# EAGLE design psas_c3_team05 (EAGLE 7.3.0)
DIST: Digi-Key
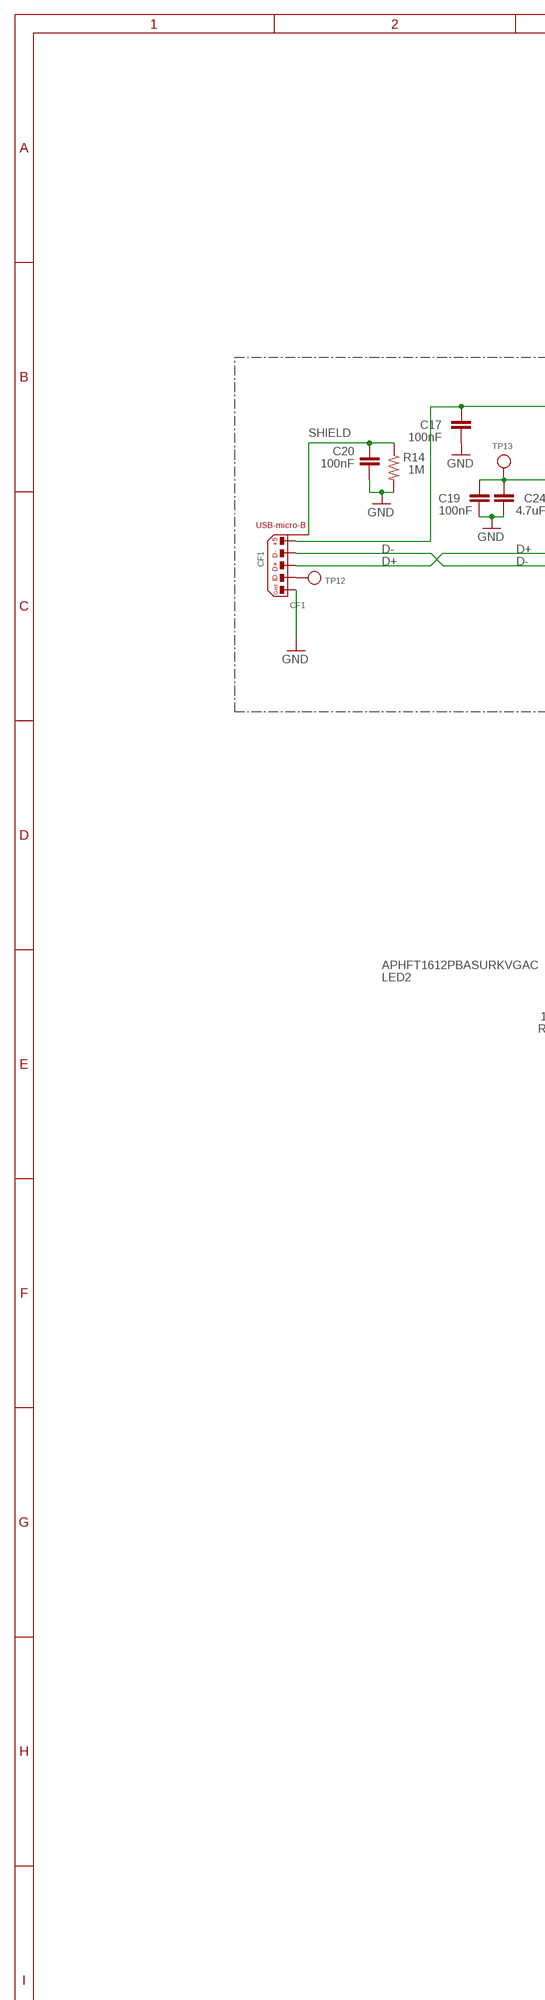
[diagram p0: schematic, sheet 1, part 1 of 2]
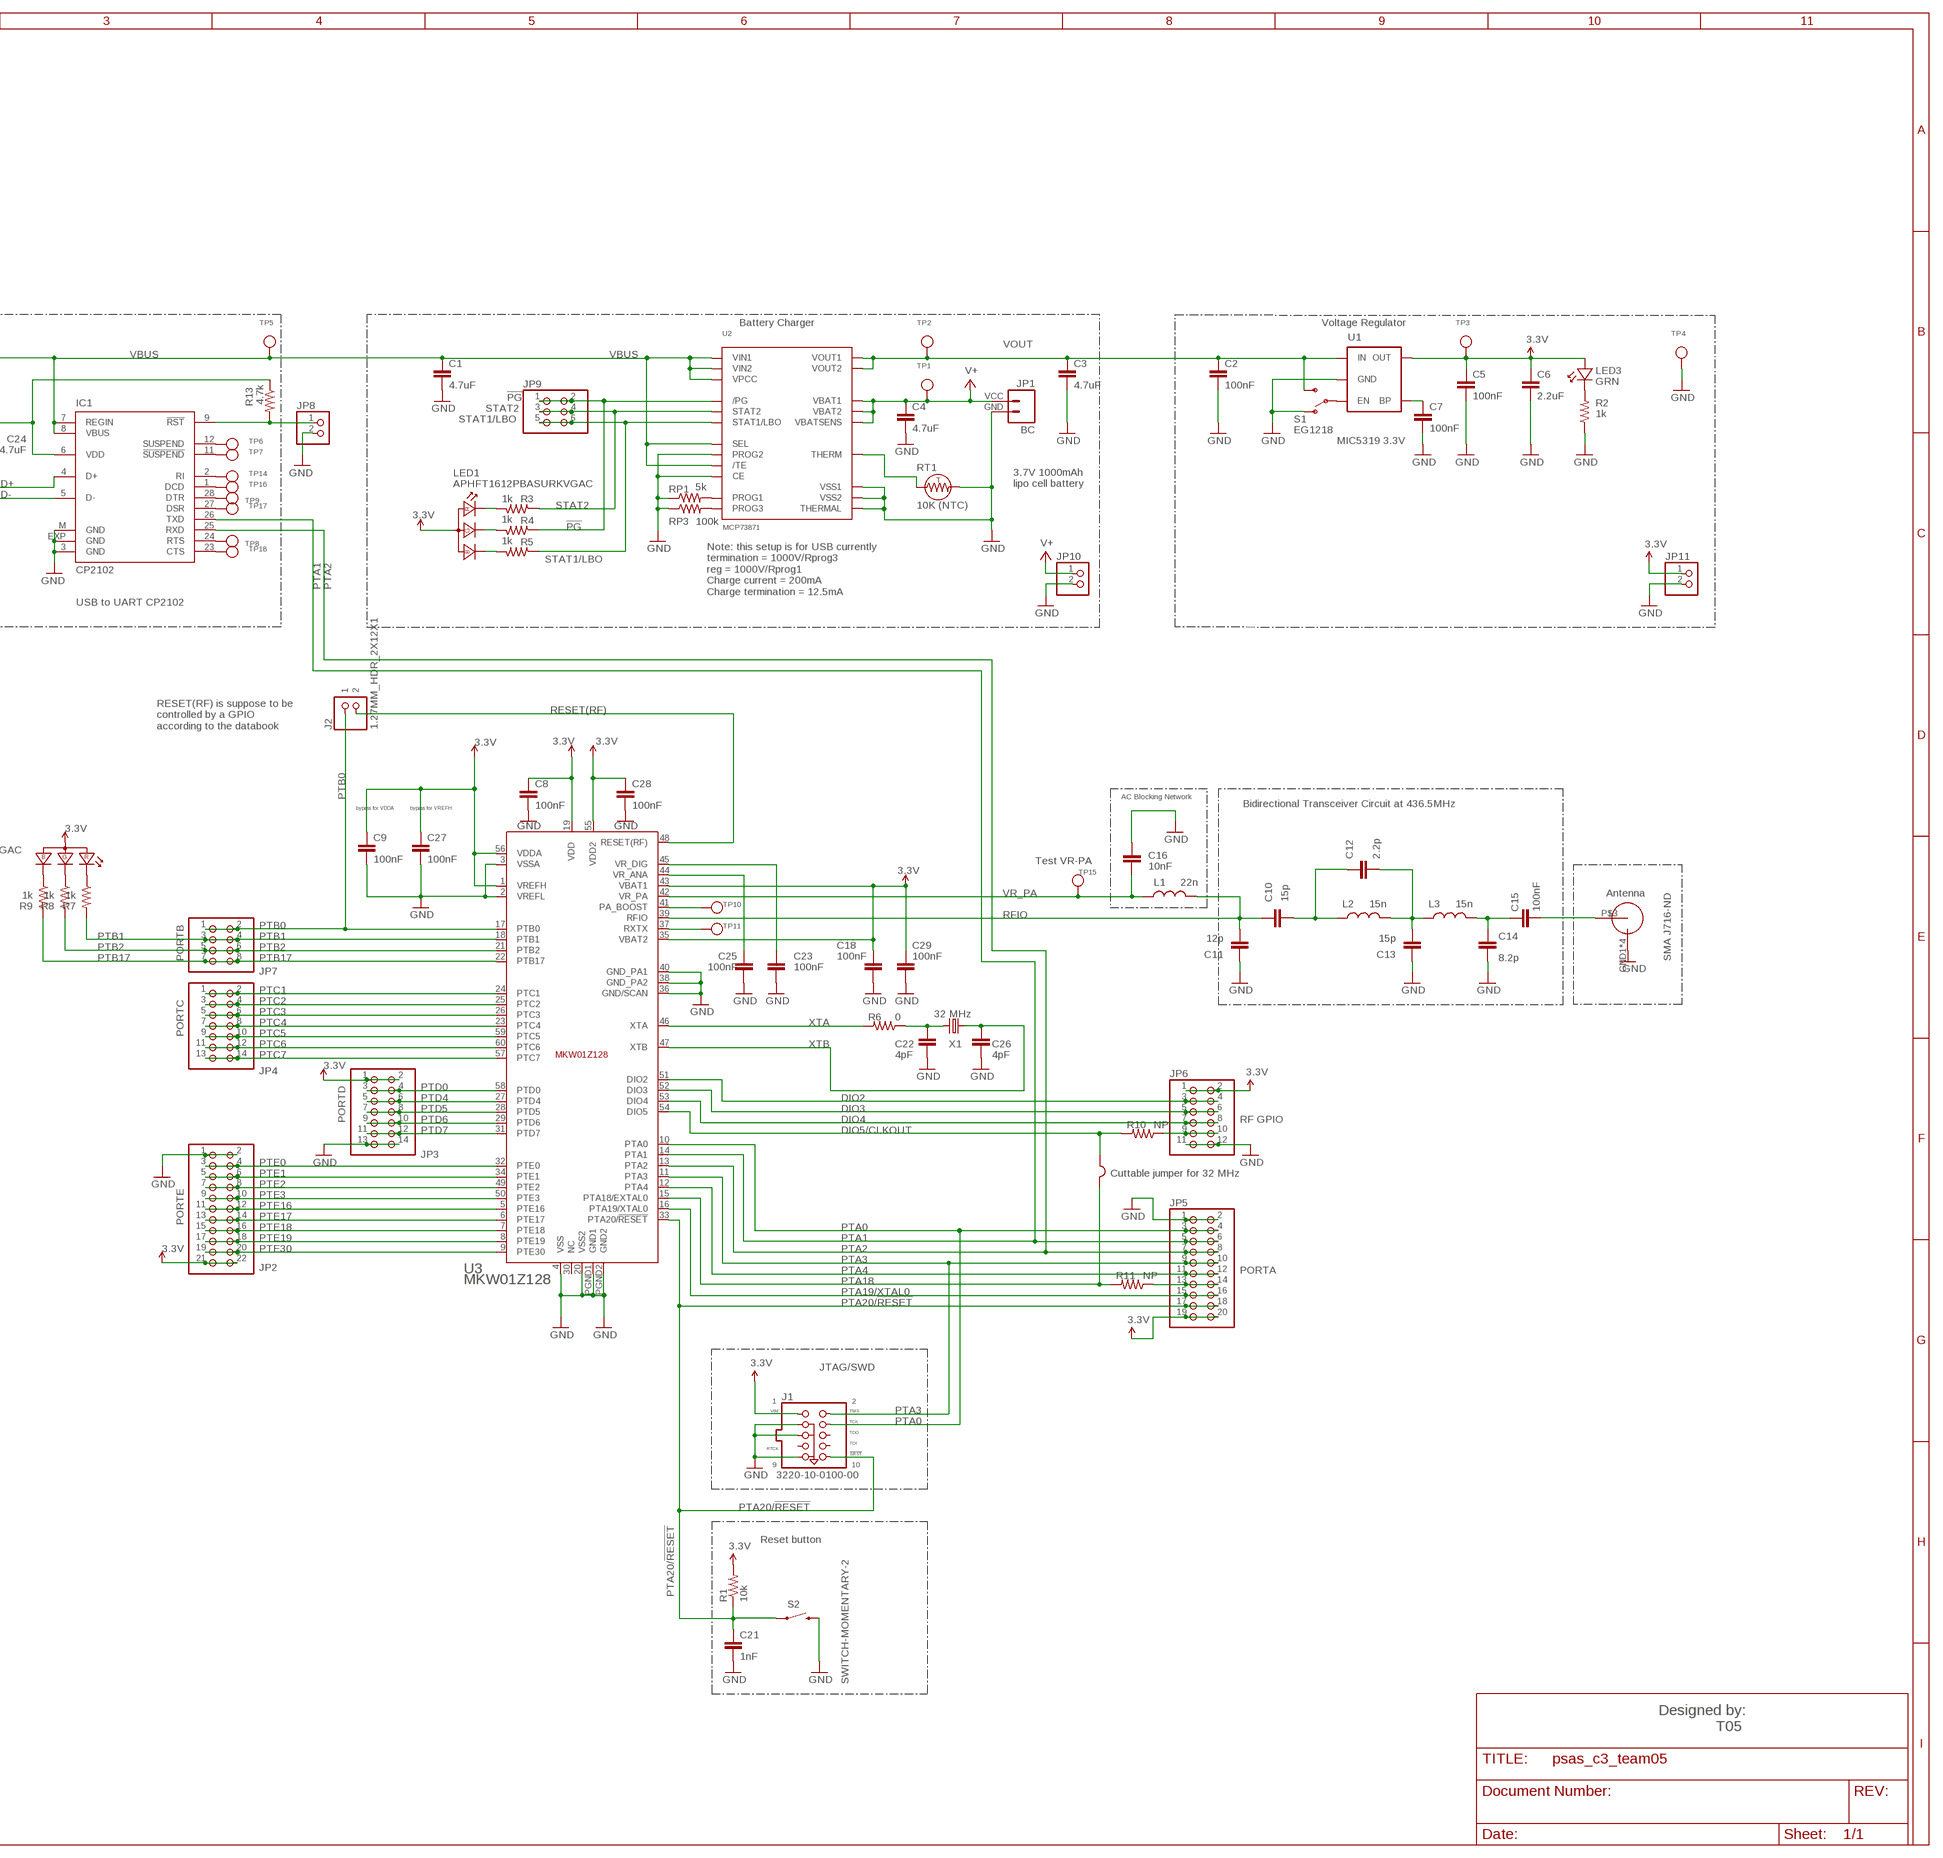
[diagram p1: schematic, sheet 1, part 2 of 2]

## Parts
C1  4.7uF  C-EU0805-B-NOSILK  [.0805-B-NOSILK]
C2  100nF  C-EU0603-B-NOSILK  [.0603-B-NOSILK]
C3  4.7uF  C-EU0805-B-NOSILK  [.0805-B-NOSILK]
C4  4.7uF  C-EU0805-B-NOSILK  [.0805-B-NOSILK]
C5  100nF  C-EU0603-B-NOSILK  [.0603-B-NOSILK]
C6  2.2uF  C-EU0805-B-NOSILK  [.0805-B-NOSILK]
C7  100nF  C-EU0603-B-NOSILK  [.0603-B-NOSILK]
C8  100nF  C-EU0603-B-NOSILK  [.0603-B-NOSILK]
C9  100nF  C-EU0603-B-NOSILK  [.0603-B-NOSILK]
C10  15p  C-EU0603-B-NOSILK  [.0603-B-NOSILK]
C11  12p  C-EU0603-B-NOSILK  [.0603-B-NOSILK]
C12  2.2p  C-EU0603-B-NOSILK  [.0603-B-NOSILK]
C13  15p  C-EU0603-B-NOSILK  [.0603-B-NOSILK]
C14  8.2p  C-EU0603-B-NOSILK  [.0603-B-NOSILK]
C15  100nF  C-EU0603-B-NOSILK  [.0603-B-NOSILK]
C16  10nF  C-EU0603-B-NOSILK  [.0603-B-NOSILK]
C17  100nF  C-EU0603-B-NOSILK  [.0603-B-NOSILK]
C18  100nF  C-EU0603-B-NOSILK  [.0603-B-NOSILK]
C19  100nF  C-EU0603-B-NOSILK  [.0603-B-NOSILK]
C20  100nF  C-EU0603-B-NOSILK  [.0603-B-NOSILK]
C21  1nF  C-EU0603-B-NOSILK  [.0603-B-NOSILK]
C22  4pF  C-EU0603-B-NOSILK  [.0603-B-NOSILK]
C23  100nF  C-EU0603-B-NOSILK  [.0603-B-NOSILK]
C24  4.7uF  C-EU0805-B-NOSILK  [.0805-B-NOSILK]
C25  100nF  C-EU0603-B-NOSILK  [.0603-B-NOSILK]
C26  4pF  C-EU0603-B-NOSILK  [.0603-B-NOSILK]
C27  100nF  C-EU0603-B-NOSILK  [.0603-B-NOSILK]
C28  100nF  C-EU0603-B-NOSILK  [.0603-B-NOSILK]
C29  100nF  C-EU0603-B-NOSILK  [.0603-B-NOSILK]
CF1  CF1  CON_USB-MICRO-B-RECEPTACLE-PTH-HIROSE-ZX62D-B-5P8  [USB-MICRO-B-PTH-HIROSE]
IC1  CP2102  [MLP28]
J1  3220-10-0100-00  JTAG_ARM-10-50MIL  [PINHEADER-2X5-0.05+POL+SILK]
J2  1.27MM_HDR_2X12X1  [1.27MM_2X1]
JP1  BC  SPARKFUN-CONNECTORS_M024UCON-15767  [SPARKFUN-CONNECTORS_JST-2-SMD-VERT]
JP2  PINHD-2X11  [2X11]
JP3  PINHD-2X7  [2X07]
JP4  PINHD-2X7  [2X07]
JP5  PINHD-2X10  [2X10]
JP6  PINHD-2X6  [2X06]
JP7  PINHD-2X4  [2X04]
JP8  PINHD-1X2  [1X02]
JP9  PINHD-2X3  [2X03]
JP10  PINHD-1X2  [1X02]
JP11  PINHD-1X2  [1X02]
L1  22n  L-US0603-B-NOSILK  [.0603-B-NOSILK]
L2  15n  L-US0603-B-NOSILK  [.0603-B-NOSILK]
L3  15n  L-US0603-B-NOSILK  [.0603-B-NOSILK]
LED1  APHFT1612PBASURKVGAC  LED_RGB_COMMON_ANODE-1.6X1.26  [KINGBRITE_RGBLED_1.6X1.26]
LED2  APHFT1612PBASURKVGAC  LED_RGB_COMMON_ANODE-1.6X1.26  [KINGBRITE_RGBLED_1.6X1.26]
LED3  GRN  LED-0603  [LED-0603]
R1  10k  R-US_0603-B-NOSILK  [.0603-B-NOSILK]
R2  1k  R-US_0603-B-NOSILK  [.0603-B-NOSILK]
R3  1k  R-US_0603-B-NOSILK  [.0603-B-NOSILK]
R4  1k  R-US_0603-B-NOSILK  [.0603-B-NOSILK]
R5  1k  R-US_0603-B-NOSILK  [.0603-B-NOSILK]
R6  0  R-US_0603-B-NOSILK  [.0603-B-NOSILK]
R7  1k  R-US_0603-B-NOSILK  [.0603-B-NOSILK]
R8  1k  R-US_0603-B-NOSILK  [.0603-B-NOSILK]
R9  1k  R-US_0603-B-NOSILK  [.0603-B-NOSILK]
R10  NP  R-US_0603-B-NOSILK  [.0603-B-NOSILK]
R11  NP  R-US_0603-B-NOSILK  [.0603-B-NOSILK]
R13  4.7k  R-US_0603-B-NOSILK  [.0603-B-NOSILK]
R14  1M  R-US_0603-B-NOSILK  [.0603-B-NOSILK]
RP1  5k  R-US_0603-B-NOSILK  [.0603-B-NOSILK]
RP3  100k  R-US_0603-B-NOSILK  [.0603-B-NOSILK]
RT1  10K (NTC)  THERMISTOR-_1206  [R1206]
S1  EG1218  SWITCH-SPSTPTH  [SWITCH-SPDT]
S2  SWITCH-MOMENTARY-2  [TACTILE_SWITCH_TALL]
TP1  TESTPOINTROUND0.5MM  [TESTPOINT_ROUND_0.5MM]
TP2  TESTPOINTROUND0.5MM  [TESTPOINT_ROUND_0.5MM]
TP3  TESTPOINTROUND0.5MM  [TESTPOINT_ROUND_0.5MM]
TP4  TESTPOINTROUND0.5MM  [TESTPOINT_ROUND_0.5MM]
TP5  TESTPOINTROUND0.5MM  [TESTPOINT_ROUND_0.5MM]
TP6  TESTPOINTROUND0.5MM  [TESTPOINT_ROUND_0.5MM]
TP7  TESTPOINTROUND0.5MM  [TESTPOINT_ROUND_0.5MM]
TP8  TESTPOINTROUND0.5MM  [TESTPOINT_ROUND_0.5MM]
TP9  TESTPOINTROUND0.5MM  [TESTPOINT_ROUND_0.5MM]
TP10  TESTPOINTROUND0.5MM  [TESTPOINT_ROUND_0.5MM]
TP11  TESTPOINTROUND0.5MM  [TESTPOINT_ROUND_0.5MM]
TP12  TESTPOINTROUND0.5MM  [TESTPOINT_ROUND_0.5MM]
TP13  TESTPOINTROUND0.5MM  [TESTPOINT_ROUND_0.5MM]
TP14  TESTPOINTROUND0.5MM  [TESTPOINT_ROUND_0.5MM]
TP15  TESTPOINTROUND0.5MM  [TESTPOINT_ROUND_0.5MM]
TP16  TESTPOINTROUND0.5MM  [TESTPOINT_ROUND_0.5MM]
TP17  TESTPOINTROUND0.5MM  [TESTPOINT_ROUND_0.5MM]
TP18  TESTPOINTROUND0.5MM  [TESTPOINT_ROUND_0.5MM]
U1  MIC5319 3.3V  SPARKFUN-POWERIC_V_REG_MIC52193.3V  [SPARKFUN-POWERIC_SOT23-5]
U2  MCP73871  [QFN20_4MM]
U3  MKW01Z128  [MKW01Z128]
U$2  SMAJ716-ND  [SMAJ716-ND]
W1  CONNECTION-0.4  [CONNECTION-BUTT-0.4]
X1  32 MHz  FC-12M  [FC-12M]

## Nets
3.3V: C5.1 C6.1 C8.1 C9.1 C18.1 C27.1 C28.1 C29.1 J1.1(VDD) JP2.21 JP2.22 JP3.1 JP3.2 JP5.19 JP5.20 JP6.1 JP6.2 JP11.1 LED1.2(COMMON_ANODE) LED2.2(COMMON_ANODE) LED3.A R1.2 TP3.P$1 U1.5(OUT) U3.1(VREFH) U3.19(VDD) U3.35(VBAT2) U3.43(VBAT1) U3.55(VDD2) U3.56(VDDA)
!PG: JP9.1 JP9.2 R4.1 U2.P$6(/PG)
CP2102_VDD: C19.1 C24.1 IC1.6(VDD) R13.1 TP13.P$1
D+: CF1.3 IC1.4(D+)
D-: CF1.2 IC1.5(D-)
DIO2: JP6.3 JP6.4 U3.51(DIO2)
DIO3: JP6.5 JP6.6 U3.52(DIO3)
DIO4: JP6.7 JP6.8 U3.53(DIO4)
DIO5-JMP: JP6.9 JP6.10 R10.1
DIO5/CLKOUT: R10.2 U3.54(DIO5) W1.P1
GND: C1.2 C2.2 C3.2 C4.2 C5.2 C6.2 C7.2 C8.2 C9.2 C11.2 C13.2 C14.2 C16.1 C17.2 C18.2 C19.2 C20.2 C21.2 C22.2 C23.2 C24.2 C25.2 C26.2 C27.2 C28.2 C29.2 CF1.5 IC1.3(GND) IC1.EXP(GND) IC1.M(GND) J1.3(GND3) J1.5(GND5) J1.9(GND9) JP1.GND JP2.1 JP2.2 JP3.13 JP3.14 JP5.1 JP5.2 JP6.11 JP6.12 JP8.2 JP10.2 JP11.2 R2.1 R14.2 RP1.1 RP3.1 RT1.2 S1.1(O) S2.B2 TP4.P$1 U1.2(GND) U2.P$4(PROG2) U2.P$10(VSS1) U2.P$11(VSS2) U2.P$17(CE) U2.P$21(THERMAL) U3.2(VREFL) U3.3(VSSA) U3.4(VSS) U3.20(VSS2) U3.36(GND/SCAN) U3.38(GND_PA2) U3.40(GND_PA1) U3.PGND1(GND1) U3.PGND2(GND2) U$2.GND1(OUTERCONDUCTOR) U$2.GND2(OUTERCONDUCTOR) U$2.GND3(OUTERCONDUCTOR) U$2.GND4(OUTERCONDUCTOR)
N$1: C7.1 U1.4(BP)
N$2: LED1.3(RK) R3.2
N$3: LED1.4(GK) R4.2
N$4: LED1.1(BK) R5.2
N$5: IC1.12(SUSPEND) TP6.P$1
N$6: RT1.1 U2.P$5(THERM)
N$7: IC1.11(!SUSPEND) TP7.P$1
N$8: S1.2(P) U1.3(EN)
N$9: RP1.2 U2.P$13(PROG1)
N$10: RP3.2 U2.P$12(PROG3)
N$11: IC1.24(RTS) TP8.P$1
N$12: C22.1 R6.1 X1.2
N$13: TP10.P$1 U3.41(PA_BOOST)
N$15: TP11.P$1 U3.37(RXTX)
N$17: C12.1 C13.1 L2.2 L3.1
N$18: C10.1 C12.2 L2.1
N$19: C15.2 U$2.P$3(CENTERCONDUCTOR)
N$21: C14.1 C15.1 L3.2
N$25: IC1.2(RI) TP14.P$1
N$26: IC1.28(DTR) TP9.P$1
N$27: IC1.1(DCD) TP16.P$1
N$28: IC1.27(DSR) TP17.P$1
N$29: IC1.23(CTS) TP18.P$1
N$30: IC1.9(!RST) JP8.1 R13.2
N$31: LED3.K R2.2
N$32: LED2.1(BK) R9.1
N$33: LED2.4(GK) R8.1
N$34: LED2.3(RK) R7.1
N$150: CF1.4 TP12.P$1
PTA0: J1.4(TCK) JP5.3 JP5.4 U3.10(PTA0)
PTA1: IC1.26(TXD) JP5.5 JP5.6 U3.14(PTA1)
PTA2: IC1.25(RXD) JP5.7 JP5.8 U3.13(PTA2)
PTA3: J1.2(TMS) JP5.9 JP5.10 U3.11(PTA3)
PTA4: JP5.11 JP5.12 U3.12(PTA4)
PTA18: R11.2 U3.15(PTA18/EXTAL0) W1.P2
PTA18-JMP: JP5.13 JP5.14 R11.1
PTA19/XTAL0: JP5.15 JP5.16 U3.16(PTA19/XTAL0)
PTA20/!RESET: C21.1 J1.10(SRST) JP5.17 JP5.18 R1.1 S2.A2 U3.33(PTA20/!RESET)
PTB0: J2.1 JP7.1 JP7.2 U3.17(PTB0)
PTB1: JP7.3 JP7.4 R7.2 U3.18(PTB1)
PTB2: JP7.5 JP7.6 R8.2 U3.21(PTB2)
PTB17: JP7.7 JP7.8 R9.2 U3.22(PTB17)
PTC1: JP4.1 JP4.2 U3.24(PTC1)
PTC2: JP4.3 JP4.4 U3.25(PTC2)
PTC3: JP4.5 JP4.6 U3.26(PTC3)
PTC4: JP4.7 JP4.8 U3.23(PTC4)
PTC5: JP4.9 JP4.10 U3.59(PTC5)
PTC6: JP4.11 JP4.12 U3.60(PTC6)
PTC7: JP4.13 JP4.14 U3.57(PTC7)
PTD0: JP3.3 JP3.4 U3.58(PTD0)
PTD4: JP3.5 JP3.6 U3.27(PTD4)
PTD5: JP3.7 JP3.8 U3.28(PTD5)
PTD6: JP3.9 JP3.10 U3.29(PTD6)
PTD7: JP3.11 JP3.12 U3.31(PTD7)
PTE0: JP2.3 JP2.4 U3.32(PTE0)
PTE1: JP2.5 JP2.6 U3.34(PTE1)
PTE2: JP2.7 JP2.8 U3.49(PTE2)
PTE3: JP2.9 JP2.10 U3.50(PTE3)
PTE16: JP2.11 JP2.12 U3.5(PTE16)
PTE17: JP2.13 JP2.14 U3.6(PTE17)
PTE18: JP2.15 JP2.16 U3.7(PTE18)
PTE19: JP2.17 JP2.18 U3.8(PTE19)
PTE30: JP2.19 JP2.20 U3.9(PTE30)
RESET(RF): J2.2 U3.48(RESET(RF))
RFIO: C10.2 C11.1 L1.2 U3.39(RFIO)
SHIELD: C20.1 CF1.S1(SHIELD) CF1.S2(SHIELD) CF1.S3(SHIELD) CF1.S4(SHIELD) R14.1
STAT1/LBO: JP9.5 JP9.6 R5.1 U2.P$8(STAT1/LBO)
STAT2: JP9.3 JP9.4 R3.1 U2.P$7(STAT2)
V+: C4.1 JP1.VCC JP10.1 TP1.P$1 U2.P$14(VBAT1) U2.P$15(VBAT2) U2.P$16(VBATSENS)
VBUS: C1.1 C17.1 CF1.1 IC1.7(REGIN) IC1.8(VBUS) TP5.P$1 U2.P$2(VPCC) U2.P$3(SEL) U2.P$9(/TE) U2.P$18(VIN1) U2.P$19(VIN2)
VOUT: C2.1 C3.1 S1.3(S) TP2.P$1 U1.1(IN) U2.P$1(VOUT1) U2.P$20(VOUT2)
VR_ANA: C25.1 U3.44(VR_ANA)
VR_DIG: C23.1 U3.45(VR_DIG)
VR_PA: C16.2 L1.1 TP15.P$1 U3.42(VR_PA)
XTA: R6.2 U3.46(XTA)
XTB: C26.1 U3.47(XTB) X1.1
Unconnected: J1.6(TDO) J1.7(RTCK) J1.8(TDI) U3.30(NC)

## Notes on the sheet
- Battery Charger | Voltage Regulator
- 3.7V 1000mAh
  lipo cell battery
- Note: this setup is for USB currently
  termination = 1000V/Rprog3
  reg = 1000V/Rprog1
  Charge current = 200mA
  Charge termination = 12.5mA
- USB to UART CP2102
- RESET(RF) is suppose to be
  controlled by a GPIO
  according to the databook
- AC Blocking Network | Bidirectional Transceiver Circuit at 436.5MHz
- bypass for VDDA | bypass for VREFH
- Test VR-PA
- Antenna
- PORTB | SMA J716-ND
- PORTC
- PORTD | RF GPIO
- Cuttable jumper for 32 MHz
- PORTE
- PORTA
- JTAG/SWD
- Reset button
- Designed by:
  T05

## Library data of the parts
C1 C3 C4 C24 = rcl_custom:C-EU: CAPACITOR, European symbol; DIST: Digi-Key; DPN: 732-7657-1-ND; MFG: Wurth Electronics Inc; MFG-PN: 885012207025
C2 C5 C7 C17 C19 C20 = rcl_custom:C-EU: CAPACITOR, European symbol; DIST: Digi-Key; DPN: 490-1532-1-ND; MFG: Murata Electronics North America; MFG-PN: GRM188R71C104KA01D
C6 = rcl_custom:C-EU: CAPACITOR, European symbol; DIST: Digi-Key; DPN: 490-3906-1-ND; MFG: Murata Electronics North America; MFG-PN: GRM21BR71C225KA12L
C8 C9 C18 C23 C25 C27-C29 = Vibrogait_prototype:C-EU: CAPACITOR, European symbol; DIST: Digi-Key; DPN: 490-1532-1-ND; MFG: Murata Electronics North America; MPN: GRM188R71C104KA01D
C10 C13 = rcl_custom:C-EU: CAPACITOR, European symbol; DIST: Digi-Key; DPN: 478-6024-1-ND; MFG: AVX; MFG-PN: 06031A150FAT2A
C11 = rcl_custom:C-EU: CAPACITOR, European symbol; DIST: Mouser; DPN: 581-06035A120FAT2A; MFG: AVX; MFG-PN: 06035A120FAT2A
C12 = rcl_custom:C-EU: CAPACITOR, European symbol; DIST: Mouser; DPN: 77-VJ0603A2R2BXJPBC; MFG: Vishay / Vitramon; MFG-PN: VJ0603A2R2BXJPW1BC
C14 = rcl_custom:C-EU: CAPACITOR, European symbol; DIST: Mouser; DPN: 609-251R14S8R2BV4T; MFG: Johanson Technology; MFG-PN: 251R14S8R2BV4T
C15 = rcl_custom:C-EU: CAPACITOR, European symbol; DIST: Digi-Key; DPN: 478-5778-1-ND; MFG: AVX; MFG-PN: 06035C104JAT2A
C16 = rcl_custom:C-EU: CAPACITOR, European symbol; DIST: Digi-Key; DPN: 478-6208-1-ND; MFG: AVX; MFG-PN: 0603YC103JAT2A
C21 = rcl_custom:C-EU: CAPACITOR, European symbol; DIST: Digi-Key; DPN: 399-8984-1-ND; MFG: Kemet; MFG-PN: C0603C102K8RACTU
C22 C26 = Vibrogait_prototype:C-EU: CAPACITOR, European symbol; DIST: Digi-Key; DPN: 490-10720-6-ND; MFG: Murata Electronics North America; MPN: GRM1885C1H4R0CA01D
CF1 = Vibrogait_prototype:CON_USB-MICRO-B-RECEPTACLE-*: Standard USB Micro-B receptacle; DIST: Digi-Key; DPN: H11610CT-ND; MFG: Hirose Electric Co Ltd; MFG-PN: ZX62D-B-5P8
IC1 = silabs:CP210*: Single-Chip USB to UART Bridge Source: www.silabs.com .. CP2101.pdf / cp2102.pdf; DIST: Digi-Key; DPN: 336-1160-1-ND; MF: FARNELL; MFG: Silicon Labs; MFG-PN: CP2102-GMR; MPN: CP2102-GM; OC_FARNELL: 9282130; OC_NEWARK: 30K5635
J1 = apdm-ic-v2:JTAG_ARM-10-*: JTAG PIN HEADER 2x5 This is one of the (smaller) ARM standard JTAG connectors.; DIST: Digi-Key; DPN: 1175-1627-ND; MFG: CNC Tech; MFG-PN: 3220-10-0100-00
J2 = headers:1.27MM_HDR_2X1
JP1 = Vibrogait_prototype:SPARKFUN-CONNECTORS_M02: Standard 2-pin 0.1" header. Use with - straight break away headers ( PRT-00116) - right angle break away headers (PRT-00553) - swiss pins (PRT-00743) - machine pins (PRT-00117) - female headers (PRT-00115) Molex polarized connector foot print use with: PRT-08233 with associated crimp pins and housings. 2.54_SCREWTERM for use with PRT-10571. 3.5mm Screw Terminal footprints for PRT-08084 5mm Screw Terminal footprints for use with PRT-08433; DIST: Digi-Key; DPN: 455-1749-1-ND; MFG: JST Sales America Inc.; MFG-PN: S2B-PH-SM4-TB(LF)(SN)
JP2 = pinhead:PINHD-2X11: PIN HEADER
JP3 JP4 = pinhead:PINHD-2X7: PIN HEADER
JP5 = pinhead:PINHD-2X10: PIN HEADER
JP6 = pinhead:PINHD-2X6: PIN HEADER
JP7 = pinhead:PINHD-2X4: PIN HEADER
JP8 JP10 JP11 = pinhead:PINHD-1X2: PIN HEADER
JP9 = pinhead:PINHD-2X3: PIN HEADER
L1 = rcl_custom:L-US: INDUCTOR, American symbol; DIST: Digi-Key; DPN: 490-6874-1-ND; MFG: Murata; MFG-PN: LQW18AN22NG00D
L2 L3 = rcl_custom:L-US: INDUCTOR, American symbol; DIST: Digi-Key; DPN: 490-6866-1-ND; MFG: Murata; MFG-PN: LQW18AN15NG00D
LED1 LED2 = Vibrogait_prototype:LED_RGB_COMMON_ANODE-*: RGB LED with comon anode; DIST: Digi-Key; DPN: 160-2022-1-ND; MFG: Lite-On Inc.; MFG-PN: LTST-C19FD1WT
LED3 = Vibrogait_prototype:LED: Generic LED with Color designator as an attribute.; DIST: Digi-Key; DPN: 160-1446-1-ND; MFG: Lite-On Inc.; MFG-PN: LTST-C191KGKT
R1 = rcl_custom:R-US_: RESISTOR, American symbol; DIST: Digi-Key; DPN: 311-10.0KHRCT-ND; MFG: Yageo; MFG-PN: RC0603FR-0710KL
R2-R5 R7-R9 = rcl_custom:R-US_: RESISTOR, American symbol; DIST: Digi-Key; DPN: 311-1.00KHRCT-ND; MFG: Yageo; MFG-PN: RC0603FR-071KL
R6 R10 R11 = rcl_custom:R-US_: RESISTOR, American symbol
R13 = rcl_custom:R-US_: RESISTOR, American symbol; DIST: Digi-Key; DPN: YAG1317CT-ND; MFG: Yageo; MFG-PN: RC0603JR-074K7P
R14 = rcl_custom:R-US_: RESISTOR, American symbol; DIST: Digi-Key; DPN: 311-1.00MHRCT-ND; MFG: Yageo; MFG-PN: RC0603FR-071ML
RP1 = rcl_custom:R-US_: RESISTOR, American symbol; DIST: Digi-Key; DPN: YAG1305CT-ND; MFG: Yageo; MFG-PN: RC0603FR-074K99P
RP3 = rcl_custom:R-US_: RESISTOR, American symbol; DIST: Digi-Key; DPN: 311-100KHRCT-ND; MFG: Yageo; MFG-PN: RC0603FR-07100KL
RT1 = Vibrogait_prototype:THERMISTOR-: Thermistor; DIST: Digi-Key; DPN: 480-3153-1-ND; MFG: Honeywell Sensing and Control; MFG-PN: 175-103LAE-301
S1 = Vibrogait_prototype:SWITCH-SPST: SPST Switch Simple slide switch. Spark Fun Electronics SKU : COM-00102; DIST: Digi-Key; DPN: EG1903-ND; MFG: E-Switch; MFG-PN: EG1218
S2 = Vibrogait_prototype:SWITCH-MOMENTARY-2; DIST: Digi-Key; DPN: 450-1759-1-ND; MFG: TE Connectivity Alcoswitch Switches; MFG-PN: FSM4JSMATR
TP1-TP18 = microbuilder:TESTPOINT: Test Point Various test points for characterisation and PCB testing TESTPOINT_SMT - Compact Surface Mount Test Point [Digikey: 5016KTR-ND]
U1 = Vibrogait_prototype:SPARKFUN-POWERIC_V_REG_MIC5219: V_REG MIC5219 Standard 3.3V and 5V 500mA LDO voltage regulator in SOT-23 layout. Micrel part MIC5219. BP (by-pass) pin is used to lower output noise with 470pF cap, may be left open.; DIST: Digi-Key; DPN: 576-1910-1-ND; MFG: Microchip Technology; MFG-PN: MIC5319-3.3YD5-TR; PROD_ID: VREG-09872; VALUE: MIC5219 3.3V
U2 = microbuilder:MCP73871: MCP73871 Lithium Polymer Battery Charger Digikey: MCP73871-2CCI/ML-ND; DIST: Digi-Key; DPN: MCP73871-2CCI/ML-ND; MFG: Microchip Technology; MFG-PN: MCP73871-2CCI/ML
U3 = psas_c3_team05:MKW01Z128; DIST: Digi-Key; DPN: MKW01Z128CHN-ND; MFG: Freescale Semiconductor; MFG-PN: MKW01Z128CHN
U$2 = SMAJ16-ND:SMAJ716-ND; DIST: Digi-Key; DPN: J716-ND; MFG: Cinch Connectivity Solutions; MFG-PN: 142-0701-806
W1 = apdm:CONNECTION: Connection Used to electrically connect two different nets. an overlap error will be generated on DRC, no known work around as of v5, though the error can be "approved".
X1 = crystal:FC-12M: kHz RANGE CRYSTAL UNIT LOW PROFILE SMD Source: Epson Toyocom FC-12M.pdf; DIST: Digi-Key; DPN: 1253-1161-1-ND; MFG: AVX Corp/Kyocera Corp; MFG-PN: CX3225GA32000D0PTVCC

## Board
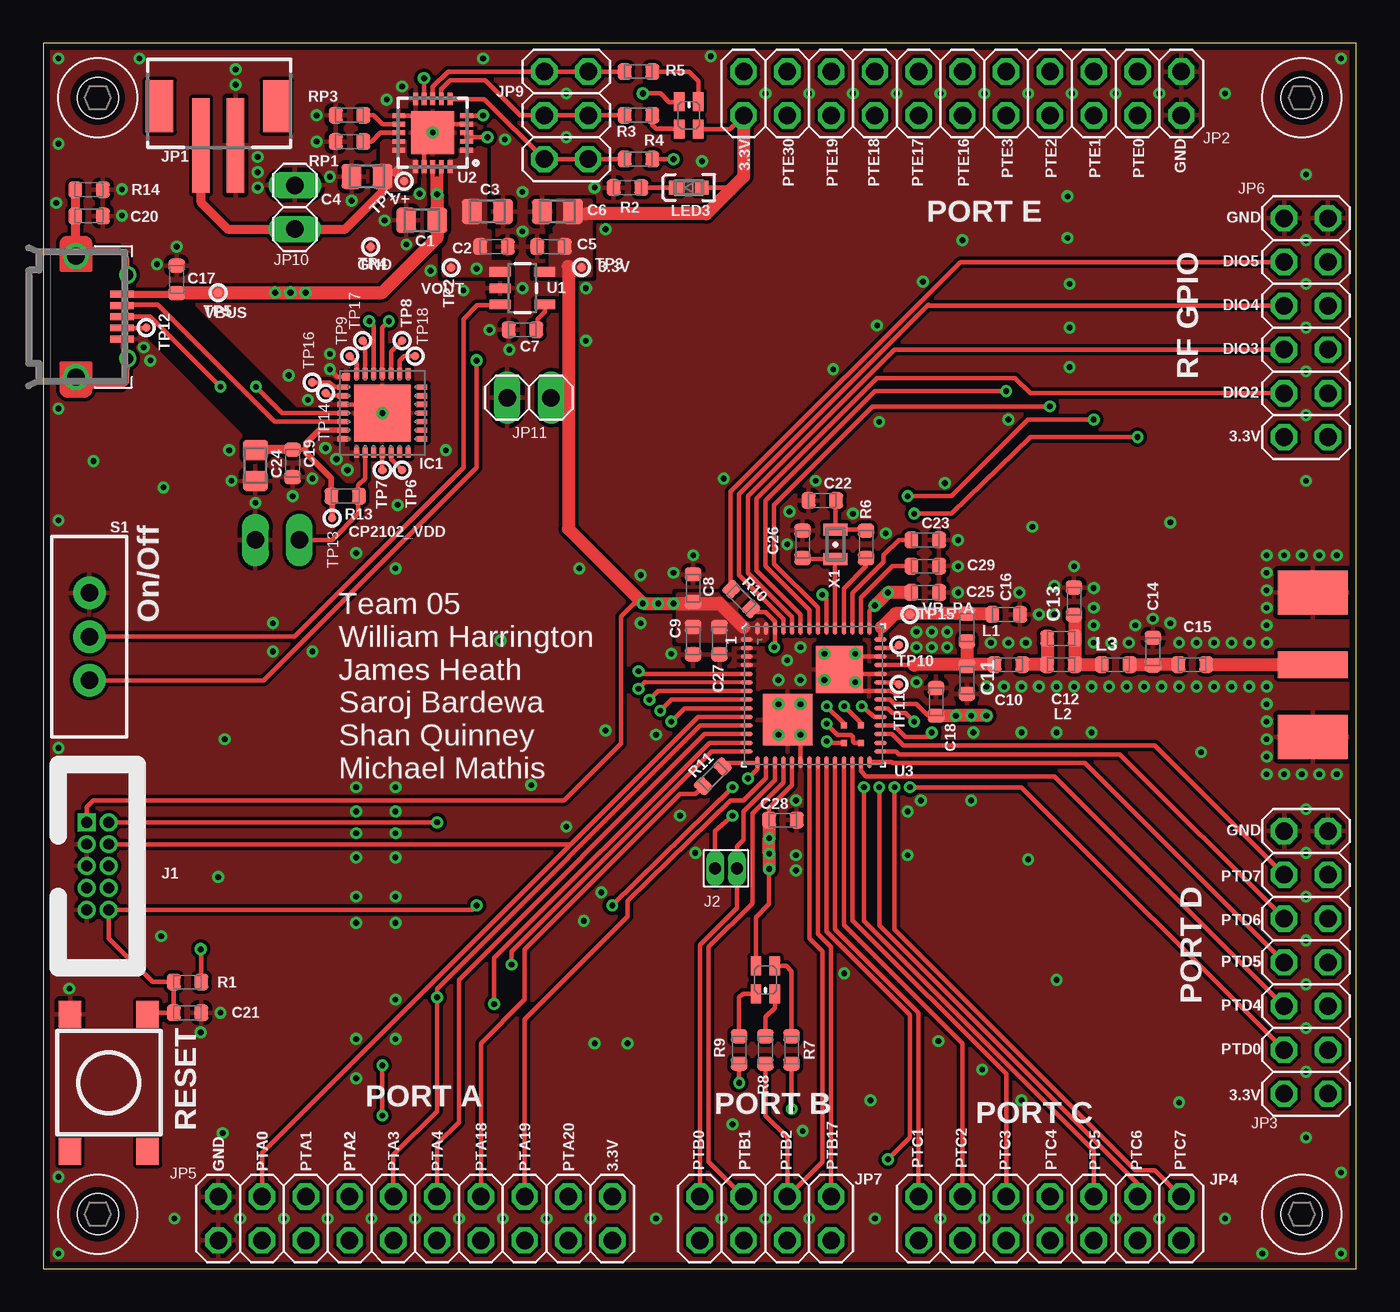
[diagram p2: board, top side]
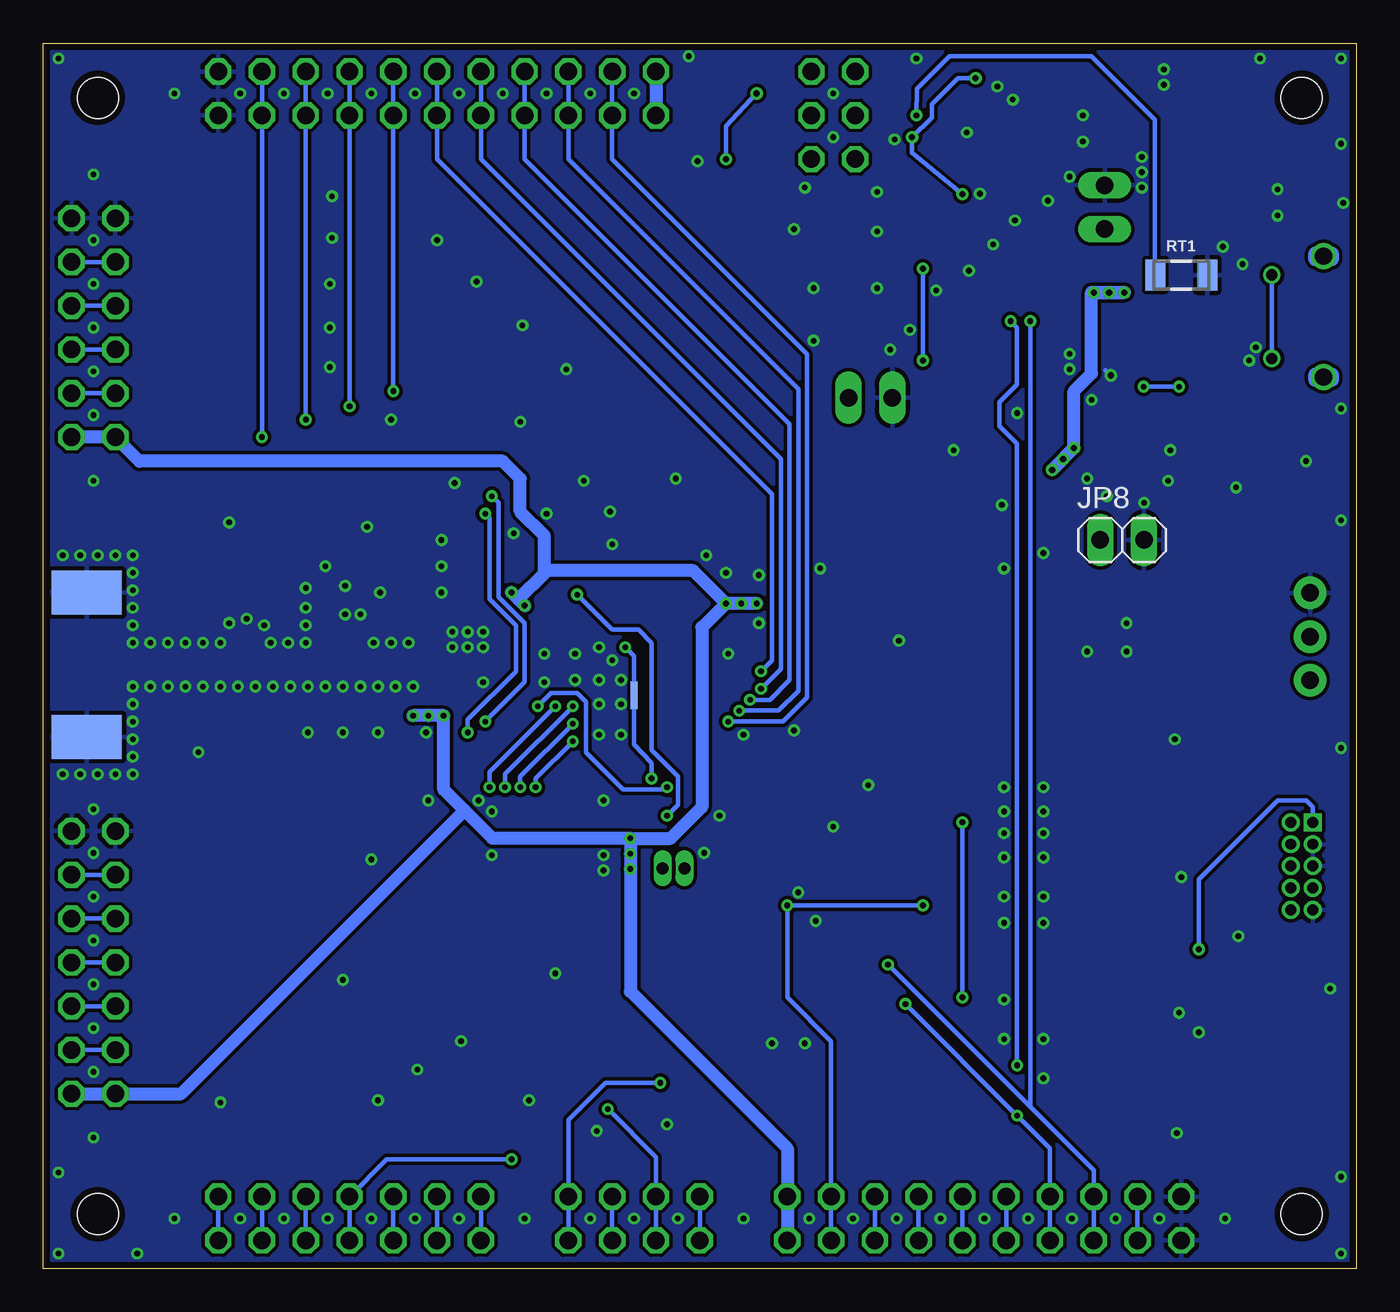
[diagram p3: board, bottom side, seen from below]

Size 76.2 x 71.12 mm. Coordinates in mm from the lower left corner, seen from the top.
Outline: 76.2,0 76.2,71.12 0,71.12 0,0 76.2,0
Copper layers (1*16): Top 0.0356mm / dielectric 1.5011mm / Bottom 0.0356mm
Design rules "LaenPCBOrder": minimum track width 6mil, minimum drill 13mil, track to track 6mil, track to pad 6mil, pad to pad 6mil, via to via 6mil, smd to smd 6mil, copper to edge 15mil, drill to drill 6mil, minimum pad ring 7mil, minimum via ring 7mil, stop-mask expansion 3mil, vias tented up to drill 0mil, thermal gap 10mil
tRestrict: 8 lines

### Footprints (pad centres in the part's own frame; a part is rotated, then mirrored left to right if it is on the bottom)
.0805-B-NOSILK = smd 1.15 x 1.45: 1 -0.9,0; 2 0.9,0
.0603-B-NOSILK = smd 0.8 x 0.95: 1 -0.8,0; 2 0.8,0
USB-MICRO-B-PTH-HIROSE = smd 0.4 x 1.35: 1 -1.3,2.675; 2 -0.65,2.675; 3 0,2.675; 4 0.65,2.675; 5 1.3,2.675 | drill 1: S1 -3.513,0; S2 3.513,0 | drill 0.65 pad 0.94: S3 2.425,3; S4 -2.425,3
#2/.750-BARE = hole 2.375: 0,0
MLP28 = smd 0.6 x 0.3: 1 -2.3,1.5; 2 -2.3,1; 3 -2.3,0.5; 4 -2.3,0; 5 -2.3,-0.5; 6 -2.3,-1; 7 -2.3,-1.5; 15 2.3,-1.5; 16 2.3,-1; 17 2.3,-0.5; 18 2.3,0; 19 2.3,0.5; 20 2.3,1; 21 2.3,1.5 | smd 0.3 x 0.6: 8 -1.5,-2.3; 9 -1,-2.3; 10 -0.5,-2.3; 11 0,-2.3; 12 0.5,-2.3; 13 1,-2.3; 14 1.5,-2.3; 22 1.5,2.3; 23 1,2.3; 24 0.5,2.3; 25 0,2.3; 26 -0.5,2.3; 27 -1,2.3; 28 -1.5,2.3 | smd 3.3 x 3.3: EXP 0,0 | smd 0.435 x 0.435: M -2.103,2.103
PINHEADER-2X5-0.05+POL+SILK = drill 0.635 pad 1.04 square: 1 -2.54,-0.635 | drill 0.635 pad 1.04: 2 -2.54,0.635; 3 -1.27,-0.635; 4 -1.27,0.635; 5 0,-0.635; 6 0,0.635; 7 1.27,-0.635; 8 1.27,0.635; 9 2.54,-0.635; 10 2.54,0.635
1.27MM_2X1 = drill 0.7 pad 1.016 long: 1 0,0.635; 2 0,-0.635
SPARKFUN-CONNECTORS_JST-2-SMD-VERT = smd 1 x 5.5: GND 1,-2; VCC -1,-2 | smd 1.6 x 3: P$1 -3.4,0.27; P$2 3.4,0.27
2X11 = drill 1.016 octagon: 1 -12.7,-1.27; 2 -12.7,1.27; 3 -10.16,-1.27; 4 -10.16,1.27; 5 -7.62,-1.27; 6 -7.62,1.27; 7 -5.08,-1.27; 8 -5.08,1.27; 9 -2.54,-1.27; 10 -2.54,1.27; 11 0,-1.27; 12 0,1.27; 13 2.54,-1.27; 14 2.54,1.27; 15 5.08,-1.27; 16 5.08,1.27; 17 7.62,-1.27; 18 7.62,1.27; 19 10.16,-1.27; 20 10.16,1.27; 21 12.7,-1.27; 22 12.7,1.27
2X07 = drill 1.016 octagon: 1 -7.62,-1.27; 2 -7.62,1.27; 3 -5.08,-1.27; 4 -5.08,1.27; 5 -2.54,-1.27; 6 -2.54,1.27; 7 0,-1.27; 8 0,1.27; 9 2.54,-1.27; 10 2.54,1.27; 11 5.08,-1.27; 12 5.08,1.27; 13 7.62,-1.27; 14 7.62,1.27
2X10 = drill 1.016 octagon: 1 -11.43,-1.27; 2 -11.43,1.27; 3 -8.89,-1.27; 4 -8.89,1.27; 5 -6.35,-1.27; 6 -6.35,1.27; 7 -3.81,-1.27; 8 -3.81,1.27; 9 -1.27,-1.27; 10 -1.27,1.27; 11 1.27,-1.27; 12 1.27,1.27; 13 3.81,-1.27; 14 3.81,1.27; 15 6.35,-1.27; 16 6.35,1.27; 17 8.89,-1.27; 18 8.89,1.27; 19 11.43,-1.27; 20 11.43,1.27
2X06 = drill 1.016 octagon: 1 -6.35,-1.27; 2 -6.35,1.27; 3 -3.81,-1.27; 4 -3.81,1.27; 5 -1.27,-1.27; 6 -1.27,1.27; 7 1.27,-1.27; 8 1.27,1.27; 9 3.81,-1.27; 10 3.81,1.27; 11 6.35,-1.27; 12 6.35,1.27
2X04 = drill 1.016 octagon: 1 -3.81,-1.27; 2 -3.81,1.27; 3 -1.27,-1.27; 4 -1.27,1.27; 5 1.27,-1.27; 6 1.27,1.27; 7 3.81,-1.27; 8 3.81,1.27
1X02 = drill 1.016 long: 1 -1.27,0; 2 1.27,0
2X03 = drill 1.016 octagon: 1 -2.54,-1.27; 2 -2.54,1.27; 3 0,-1.27; 4 0,1.27; 5 2.54,-1.27; 6 2.54,1.27
KINGBRITE_RGBLED_1.6X1.26 = smd 1.1 x 0.6: 1 0.8,-0.55; 2 -0.8,-0.55; 3 -0.8,0.55; 4 0.8,0.55
LED-0603 = smd 0.8 x 0.8: A 0.75,0; K -0.75,0
R1206 = smd 1.15 x 1.8: 1 -1.5,0; 2 1.5,0
SWITCH-SPDT = drill 1.016 pad 1.88: 1 0,2.54; 2 0,0; 3 0,-2.54
TACTILE_SWITCH_TALL = smd 1.55 x 1.3: A1 -3.975,-2.25; A2 3.975,-2.25; B1 -3.975,2.25; B2 3.975,2.25
TESTPOINT_ROUND_0.5MM = smd 0.5 x 0.5: P$1 0,0
SPARKFUN-POWERIC_SOT23-5 = smd 0.55 x 1.2: 1 -0.95,-1.3; 2 0,-1.3; 3 0.95,-1.3; 4 0.95,1.3; 5 -0.95,1.3
QFN20_4MM = smd 0.73 x 0.28: P$1 -1.965,1; P$2 -1.965,0.5; P$3 -1.965,0; P$4 -1.965,-0.5; P$5 -1.965,-1; P$11 1.965,-1; P$12 1.965,-0.5; P$13 1.965,0; P$14 1.965,0.5; P$15 1.965,1 | smd 0.28 x 0.73: P$6 -1,-1.965; P$7 -0.5,-1.965; P$8 0,-1.965; P$9 0.5,-1.965; P$10 1,-1.965; P$16 1,1.965; P$17 0.5,1.965; P$18 0,1.965; P$19 -0.5,1.965; P$20 -1,1.965 | smd 2.5 x 2.5: P$21 0,0
MKW01Z128 = smd 0.25 x 0.71: 1 -3.25,-3.878; 2 -2.75,-3.878; 3 -2.25,-3.878; 4 -1.75,-3.878; 5 -1.25,-3.878; 6 -0.75,-3.878; 7 -0.25,-3.878; 8 0.25,-3.878; 9 0.75,-3.878; 10 1.25,-3.878; 11 1.75,-3.878; 12 2.25,-3.878; 13 2.75,-3.878; 14 3.25,-3.878; 29 3.25,3.878; 30 2.75,3.878; 31 2.25,3.878; 32 1.75,3.878; 33 1.25,3.878; 34 0.75,3.878; 35 0.25,3.878; 36 -0.25,3.878; 37 -0.75,3.878; 38 -1.25,3.878; 39 -1.75,3.878; 40 -2.25,3.878; 41 -2.75,3.878; 42 -3.25,3.878 | smd 0.71 x 0.25: 15 3.878,-3.25; 16 3.878,-2.75; 17 3.878,-2.25; 18 3.878,-1.75; 19 3.878,-1.25; 20 3.878,-0.75; 21 3.878,-0.25; 22 3.878,0.25; 23 3.878,0.75; 24 3.878,1.25; 25 3.878,1.75; 26 3.878,2.25; 27 3.878,2.75; 28 3.878,3.25; 43 -3.878,3.25; 44 -3.878,2.75; 45 -3.878,2.25; 46 -3.878,1.75; 47 -3.878,1.25; 48 -3.878,0.75; 49 -3.878,0.25; 50 -3.878,-0.25; 51 -3.878,-0.75; 52 -3.878,-1.25; 53 -3.878,-1.75; 54 -3.878,-2.25; 55 -3.878,-2.75; 56 -3.878,-3.25 | smd 0.35 x 0.35: 57 1.75,1.75; 58 1.75,2.75; 59 2.75,1.75; 60 2.75,2.75 | smd 2.72 x 2.72: PGND1 -1.5,1.5 | smd 3 x 2.87: PGND2 1.42,-1.5
SMAJ716-ND = smd 2.54 x 4.064 bottom: GND1 4.191,0.508; GND3 -4.191,0.508 | smd 2.54 x 4.064: GND2 -4.191,0.508; GND4 4.191,0.508 | smd 1.524 x 4.064: P$3 0,0.508
CONNECTION-BUTT-0.4 = smd 0.8 x 0.4: P1 -0.4,0; P2 0.4,0
FC-12M = smd 0.7 x 1.4: 1 -0.85,0; 2 0.85,0

### Placement (x,y rotation side)
C1  21.97,60.83 180 top
C2  26.16,59.31 0 top
C3  25.78,61.34 0 top
C4  18.8,63.37 180 top
C5  29.46,59.31 180 top
C6  29.84,61.34 180 top
C7  27.81,54.48 180 top
C8  37.72,39.5 90 top
C9  37.72,36.45 270 top
C10  56.01,35.05 180 top
C11  53.59,34.16 270 top
C12  59.05,36.58 180 top
C13  59.82,38.73 90 top
C14  64.39,35.81 90 top
C15  66.67,35.05 0 top
C16  55.88,37.97 180 top
C17  7.75,57.4 90 top
C18  51.82,32.89 90 top
C19  14.48,46.74 270 top
C20  2.67,61.09 0 top
C21  8.38,14.86 0 top
C22  45.21,44.58 180 top
C23  51.18,42.29 0 top
C24  12.32,46.61 270 top
C25  51.18,40.77 0 top
C26  44.07,42.04 90 top
C27  39.24,36.45 270 top
C28  42.93,26.04 0 top
C29  51.18,39.24 0 top
CF1  1.91,55.24 270 top
DI1  [#2/.750-BARE]  3.17,67.94 0 top
DI2  [#2/.750-BARE]  73.03,67.94 0 top
DI3  [#2/.750-BARE]  73.03,3.17 0 top
DI4  [#2/.750-BARE]  3.17,3.17 0 top
IC1  19.68,49.66 0 top
J1  3.17,23.37 270 top
J2  39.62,23.24 270 top
JP1  10.16,67.18 0 top
JP2  53.34,68.2 180 top
JP3  73.28,17.78 90 top
JP4  58.42,2.92 0 top
JP5  21.59,2.92 0 top
JP6  73.28,54.61 90 top
JP7  41.91,2.92 0 top
JP8  13.59,42.29 0 bottom
JP9  30.35,66.93 90 top
JP10  14.61,61.59 90 top
JP11  28.19,50.55 180 top
L1  53.59,37.21 270 top
L2  59.05,35.05 0 top
L3  62.23,35.05 0 top
LED1  37.47,66.93 90 top
LED2  41.91,16.76 270 top
LED3  37.47,62.74 0 top
R1  8.38,16.64 0 top
R2  33.91,62.74 0 top
R3  34.54,66.93 0 top
R4  34.54,64.39 0 top
R5  34.54,69.47 0 top
R6  47.75,42.04 270 top
R7  43.43,12.7 270 top
R8  41.91,12.7 270 top
R9  40.39,12.7 270 top
R10  40.51,38.86 315 top
R11  38.86,28.57 45 top
R13  17.53,44.83 0 top
R14  2.67,62.61 0 top
RP1  17.78,65.41 0 top
RP3  17.78,66.93 0 top
RT1  10.16,57.66 0 bottom
S1  2.68,36.68 0 top
S2  3.81,10.79 90 top
TP1  20.95,63.12 0 top
TP2  23.67,58.09 0 top
TP3  31.23,58.11 0 top
TP4  19.01,59.29 0 top
TP5  10.16,56.64 180 top
TP6  20.83,46.35 90 top
TP7  19.68,46.35 90 top
TP8  20.83,53.85 90 top
TP9  17.78,52.96 0 top
TP10  49.66,36.2 0 top
TP11  49.66,33.91 0 top
TP12  5.97,54.61 0 top
TP13  16.76,43.56 0 top
TP14  16.38,50.8 0 top
TP15  50.29,37.97 0 top
TP16  15.62,51.44 0 top
TP17  18.54,53.85 0 top
TP18  21.59,52.96 0 top
U1  27.81,56.9 270 top
U2  22.61,65.91 180 top
U3  44.7,33.27 270 top
U$2  73.15,35.05 270 top
W1  41.91,33.27 270 bottom
X1  45.97,42.04 90 top

### Tracks (layer width: path | path; a pad name or v marks a point on that pad's centre or on a via)
3.3V  (via drill 0.33, 0.36)
  Top 0.254: 31.5,61.21 30.75,61.21 C6.1 | R1.2 9.18,18.5 v9.14,18.54 | U3.35 49.15,33.02 49.4,32.77 50.67,32.77 51.35,32.09 C18.1 | U3.19 43.45,28.07 42.13,26.74 C28.1 | J1.1 2.54,26.8 2.92,27.18 30.23,27.18 33.53,30.48 33.53,37.85 34.29,38.61 v34.8,38.61 | LED2.2 41.36,20.41 42.13,21.17 v42.13,23.2 | U3.43 47.95,38.17 v48.26,38.48 | LED3.A 39.75,62.74 39.88,62.61 | LED1.2 39.84,66.13 JP2.22
  Top 0.508: JP11.1 30.48,50.55
  Top 0.762: 30.48,58.17 30.48,50.55 30.48,42.93 v34.8,38.61 39.24,38.61 40.64,37.21 | C28.1 v42.13,24.98 v42.13,24.09 v42.13,23.2 | C29.1 v49.02,39.24 v48.26,38.48 | v54.74,32.09 v53.85,32.09 v52.96,32.09 C18.1 | JP2.22 40.64,63.37 39.88,62.61 38.48,61.21 31.5,61.21
  Bottom 0.254: v9.14,18.54 9.14,22.61 4.57,27.18 2.92,27.18 2.54,26.8 J1.1
  Bottom 0.762: v34.8,38.61 v35.69,38.61 v36.58,38.61 | v36.58,38.61 37.97,37.21 37.97,26.8 39.79,24.98 v42.13,24.98 | v42.13,24.98 v42.13,24.09 v42.13,23.2 42.13,16.09 33.02,6.99 JP5.20 JP5.19 | v36.58,38.61 38.48,40.51 46.99,40.51 47.12,40.39 | 47.12,40.39 48.64,38.86 | 48.64,38.86 v48.26,38.48 | v49.02,39.24 48.64,38.86 | v42.13,24.98 50.13,24.98 51.75,26.61 | v54.74,32.09 v53.85,32.09 v52.96,32.09 52.96,27.81 51.75,26.61 | JP2.21 JP2.22 | JP3.1 JP3.2 68.2,10.16 51.75,26.61 | 47.12,40.39 47.12,42.55 48.51,43.94 48.51,45.85 49.53,46.86 70.61,46.86 JP6.2 JP6.1
  pour Top (isolate 0.254, no thermals): 28.57,57.66 31.75,57.66 31.75,61.98 29.72,61.98 29.72,59.94 29.46,59.94 29.46,58.04 28.57,58.04
  pour Top (isolate 0.203, no thermals): 42.04,39.12 42.04,36.45 36.83,36.45 36.83,39.12
!PG
  Top 0.254: U2.P$6 25.6,67.87 JP9.2 JP9.1 R4.1
CP2102_VDD
  Top 0.254: C19.1 15.2,47.54 15.24,47.5
  Top 0.305: IC1.6 16.02,48.66 15.24,47.88 15.24,47.5 15.24,47.37 16.73,45.88 R13.1 16.76,44.79 TP13.P$1
  Top 0.508: C19.1 12.6,47.54 arc90 C24.1
D+  (via drill 0.33)
  Top 0.254: IC1.4 13.87,49.66 v12.34,51.18 | CF1.3 6.22,55.24 v10.29,51.18
  Bottom 0.254: v12.34,51.18 v10.29,51.18
D-
  Top 0.254: CF1.2 4.58,55.93 6.66,55.93 13.43,49.16 IC1.5
DIO2
  Top 0.254: U3.51 43.95,37.96 41.4,40.51 41.4,44.7 48.39,51.69 56.39,51.69 57.28,50.8 JP6.4
  Bottom 0.254: JP6.3 JP6.4
DIO3
  Top 0.254: U3.52 43.45,37.83 40.89,40.39 40.89,44.83 49.4,53.34 JP6.6
  Bottom 0.254: JP6.5 JP6.6
DIO4
  Top 0.254: U3.53 42.95,37.69 40.39,40.26 40.39,44.96 51.37,55.94 51.44,55.88 JP6.8
  Bottom 0.254: JP6.7 JP6.8
DIO5-JMP
  Top 0.254: R10.1 39.88,39.43 39.88,45.09 53.21,58.42 JP6.10
  Bottom 0.254: JP6.9 JP6.10
DIO5/CLKOUT  (via drill 0.33)
  Top 0.254: R10.2 41.27,38.1 41.91,38.1 42.45,37.56 U3.54 42.45,36.23 v42.42,36.07
  Bottom 0.254: v42.42,36.07 41.91,35.56 W1.P1
GND  (via drill 0.33, 0.36)
  Top 0.254: IC1.EXP 19.61,50.14 IC1.3 17.31,50.14 | U2.P$11 22.6,66.91 U2.P$21 | U2.P$4 22.6,66.41 U2.P$21 | U2.P$17 22.1,65.91 U2.P$21 | IC1.M 17.09,51.74 v16.64,52.2 | U3.40 47.03,35.52 46.99,35.56 | U3.38 46.63,34.52 46.61,34.54 | 46.35,34.67 47.5,33.52 U3.36 49.15,33.52 49.28,33.53 49.53,33.27 | U3.20 43.95,31.23
  Bottom 0.254: 14.55,52.15 v14.25,51.84
  other vias: 56.77,33.78 57.78,33.78 58.8,33.78 70.99,31.75 60.83,33.78 65.91,33.78 66.93,33.78 67.94,33.78 68.96,33.78 59.82,33.78 61.85,33.78 62.87,33.78 63.88,33.78 64.9,33.78 69.98,33.78 70.99,33.78 70.99,32.77 70.99,30.73 68.96,36.32 67.94,36.32 70.99,29.72 69.98,36.32 70.99,36.32 70.99,28.7 72.01,28.7 73.03,28.7 74.04,28.7 75.06,28.7 59.82,40.77 58.67,39.62 53.09,42.29 60.96,39.5 58.67,37.97 64.39,37.72 60.96,38.35 60.96,37.34 63.37,37.34 61.98,36.32 62.99,36.32 60.96,36.32 57.02,36.32 54.99,36.32 56.01,36.32 65.41,37.47 70.99,37.34 70.99,38.35 65.91,36.32 66.93,36.32 70.99,39.37 70.99,40.39 70.99,41.4 72.01,41.4 73.03,41.4 74.04,41.4 4.57,61.11 10.79,47.5 16.64,53.09 5.84,53.47 6.22,52.7 14.48,44.83 15.62,45.85 12.32,44.45 10.92,45.72 15.37,50.42 19.68,49.66 4.57,62.64 21.84,62.38 22.61,65.94 20.83,68.61 19.94,67.84 37.72,41.4 43.31,43.94 36.45,35.69 53.09,40.77 53.09,39.24 44.83,45.72 46.99,43.81 48.9,42.67 43.18,42.04 56.01,49.28 48.51,49.15 36.58,40.39 39.5,45.85 45.85,52.2 51.05,57.28 53.34,59.69 48.39,54.74 75.31,70.23 38.73,70.36 25.53,70.23 15.88,66.93 15.88,65.41 16.64,63.37 17.91,61.98 12.45,62.74 12.45,63.63 12.45,64.52 11.18,68.71 11.18,69.6 5.59,70.23 0.89,70.23 0.89,65.28 0.76,61.85 6.6,58.29 7.75,59.31 0.89,49.91 0.89,43.43 0.89,30.23 20.57,44.32 23.37,47.5 24.38,56.77 22.48,57.91 19.81,60.83 21.08,59.44 27.81,56.9 25.91,54.48 27.05,53.34 27.81,60.2 27.81,62.48 26.8,65.53 32,62.74 30.35,65.66 30.35,68.2 32.64,60.33 38.23,64.26 31.5,53.85 13.34,37.47 13.34,35.81 15.62,35.81 6.99,45.34 10.54,30.73 20.45,40.64 18.16,41.53 20.45,27.94 18.16,27.94 18.16,23.88 20.45,23.88 20.45,25.27 20.45,26.54 18.16,26.54 18.16,25.27 20.45,21.59 18.16,21.59 18.16,20.07 20.45,20.07 20.45,15.62 18.16,13.34 18.16,11.05 20.45,13.34 11.43,2.92 0.89,0.89 0.89,5.33 1.52,16.26 6.86,19.3 10.16,22.73 13.97,2.92 16.51,2.92 19.05,2.92 21.59,2.92 24.13,2.92 26.67,2.92 29.21,2.92 31.75,2.92 39.37,2.92 41.91,2.92 44.45,2.92 52.07,2.92 54.61,2.92 57.15,2.92 59.69,2.92 62.23,2.92 64.77,2.92 73.28,13.97 73.28,11.43 73.28,16.51 73.28,19.05 73.28,21.59 75.31,0.89 75.31,5.59 70.74,0.89 73.28,59.69 73.28,57.15 73.28,54.61 73.28,52.07 64.77,68.2 62.23,68.2 59.69,68.2 57.15,68.2 54.61,68.2 52.07,68.2 49.53,68.2 46.99,68.2 44.45,68.2 41.91,68.2 10.29,14.86 9.14,13.72 43.69,27.18 43.69,24 43.69,23.11 37.85,24.13 36.96,26.29 32.38,21.84 31.37,20.19 35.56,30.99 34.67,37.47 34.67,40.26 32.64,31.24 31.11,40.64 31.5,56.9 54.74,33.78 50.67,34.04 52.45,36.07 51.56,36.07 50.67,36.07 50.67,36.96 51.56,36.96 52.45,36.96 56.64,39.24 57.78,37.97 52.32,45.59 55.75,33.78 75.06,41.4 43.94,34.16 43.94,36.07 43.18,35.31 42.67,34.16 43.94,30.99 42.67,30.99 42.67,32.77 43.94,32.77 45.34,35.69 47.12,35.69 47.12,34.04 45.34,34.16 53.98,31.11 56.77,31.11 58.8,31.11 60.83,31.11 73.28,24.13 59.56,52.32 59.56,54.61 59.56,57.15 59.44,59.82 59.44,62.23 50.93,27.18 50.16,26.54 53.85,27.18 50.16,24 65.91,9.65 58.8,16.76 46.48,17.14 44.07,8 40.01,8.38 48.01,9.78 51.94,13.21 54.48,11.56 56.77,9.78 33.91,13.08 32,13.08 30.35,25.65 28.32,28.07 26.54,36.45 65.41,43.31 57.4,43.05 67.18,29.97 10.41,7.87 57.15,23.75 73.28,26.67 73.28,49.53 35.56,2.92 7.62,2.92 48.26,2.92 68.58,2.92 73.28,7.62 73.28,45.72 73.28,63.5 68.58,68.2 2.92,46.86
  pour Top (isolate 0.203, rank 6): 0,71.12 76.2,71.12 76.2,0 0,0
  pour Bottom (isolate 0.203): 0,71.12 76.2,71.12 76.2,0 0,0
N$1
  Top 0.254: U1.4 29.11,55.53 28.7,55.12 28.7,54.57 C7.1
N$2
  Top 0.254: R3.2 35.34,66.38 35.56,66.17 36.88,66.17 LED1.3
N$3  (via drill 0.36)
  Top 0.254: R4.2 v36.58,64.39 | v34.8,68.2 35.81,68.2 36.32,67.69 36.88,67.69 LED1.4
  Bottom 0.254: v36.58,64.39 36.58,66.29 v34.8,68.2
N$4
  Top 0.254: LED1.1 38.02,68.92 37.47,69.47 R5.2
N$5
  Top 0.254: IC1.12 20.18,47 TP6.P$1
N$6  (via drill 0.33)
  Top 0.254: 25.5,66.91 v25.53,66.93 25.51,66.91 U2.P$5
  Bottom 0.254: v25.53,66.93 25.5,68.48 23.62,70.36 15.37,70.36 11.68,66.67 11.68,57.68 RT1.1
N$7
  Top 0.254: IC1.11 TP7.P$1
N$8
  Top 0.254: U1.3 26.54,55.92 25.18,55.92 24.38,55.12 24.38,46.48 14.58,36.68 S1.2
N$9
  Top 0.254: U2.P$13 19.56,65.91 19.05,65.41 RP1.2
N$10
  Top 0.254: U2.P$12 19.69,66.41 19.18,66.93 RP3.2
N$11
  Top 0.254: IC1.24 20.18,53.2 TP8.P$1
N$12
  Top 0.254: 47.82,42.87 R6.1 47.7,42.89 X1.2 45.97,44.28 C22.1
  Top 0.406: 45.95,42.87 X1.2
N$13
  Top 0.254: U3.41 49.49,36.02 TP10.P$1
N$15
  Top 0.254: U3.37 49.54,34.02 TP11.P$1
N$17
  Top 0.406: 59.85,37.9 59.82,37.9 C13.1
  Top 0.762: L3.1 L2.2 C12.1 59.85,37.9
N$18
  Top 0.762: C10.1 L2.1 C12.2
N$19
  Top 0.762: C15.2 U$2.P$3
N$21
  Top 0.254: 64.52,35.05 64.39,35.05 64.26,34.92 64.3,34.92 C14.1
  Top 0.762: C15.1 64.52,35.05 | L3.2 64.39,35.05 C14.1
N$25
  Top 0.254: IC1.2 16.53,50.66 TP14.P$1
N$26
  Top 0.254: IC1.28 18.18,52.55 TP9.P$1
N$27
  Top 0.254: IC1.1 16.91,51.16 16.64,51.44 TP16.P$1
N$28
  Top 0.254: IC1.27 18.68,53.7 TP17.P$1
N$29
  Top 0.254: IC1.23 20.68,52.69 20.95,52.96 TP18.P$1
N$30
  Top 0.254: IC1.9 18.68,45.86 18.29,45.47 18.29,44.87 R13.2 18.29,44.79 18.29,43.81 16.76,42.29 JP8.1
N$31
  Top 0.254: LED3.K R2.2
N$32
  Top 0.254: R9.1 40.39,15.75 40.6,15.96 LED2.1
N$33
  Top 0.254: LED2.4 42.46,15.15 41.91,14.61 R8.1
N$34
  Top 0.254: LED2.3 43.14,17.56 43.43,17.27 R7.1
N$150
  Top 0.254: CF1.4 5.95,54.59 TP12.P$1
PTA0
  Top 0.254: U3.10 37.99,32.02 30.61,24.64 | 30.61,24.64 12.7,6.73 JP5.4 | J1.4 30.61,24.64
  Bottom 0.254: JP5.3 JP5.4
PTA1  (via drill 0.33)
  Top 0.254: U3.14 38.79,30.02 27.18,18.41 v27.18,17.65 | IC1.26 19.18,54.73 v18.92,54.99
  Bottom 0.254: 18.92,9.4 v27.18,17.65 | v18.92,54.99 18.92,9.4 | JP5.5 JP5.6 15.24,5.71 18.92,9.4
PTA2  (via drill 0.33)
  Top 0.254: U3.13 38.65,30.52 26.16,18.03 v26.16,15.37 | IC1.25 19.68,54.61 v20.07,54.99 | v19.68,11.81 v19.68,8.89
  Bottom 0.254: v26.16,15.37 v19.68,8.89 19.3,8.51 17.78,6.99 JP5.8 JP5.7 | v20.07,54.99 19.68,54.61 19.68,51.31 20.7,50.29 20.7,48.9 19.68,47.88 v19.68,11.81
PTA3  (via drill 0.33)
  Top 0.254: U3.11 38.13,31.52 22.86,16.26 v22.86,15.75 22.86,9.14 20.32,6.6 JP5.10 | J1.2 v22.86,25.91
  Bottom 0.254: v22.86,15.75 v22.86,25.91 | JP5.9 JP5.10
PTA4
  Top 0.254: U3.12 38.39,31.02 24.13,16.76 24.13,8.51 22.86,7.24 JP5.12
  Bottom 0.254: JP5.11 JP5.12
PTA18  (via drill 0.33)
  Top 0.254: R11.2 39.62,29.34 41.4,29.34 U3.15 41.45,29.01 v40.89,28.45
  Bottom 0.254: W1.P2 41.91,30.41 40.89,29.34 v40.89,28.45
PTA18-JMP
  Top 0.254: R11.1 37.85,27.56 36.96,27.56 27.94,18.54 27.94,15.62 25.4,13.08 JP5.14
  Bottom 0.254: JP5.13 JP5.14
PTA19/XTAL0
  Top 0.254: U3.16 41.95,28.49 40.64,27.18 39.88,27.18 33.91,21.34 33.91,20.45 27.94,14.48 JP5.16
  Bottom 0.254: JP5.15 JP5.16
PTA20/!RESET  (via drill 0.33)
  Top 0.254: 6.01,14.82 S2.A2 6.15,14.86 C21.1 7.58,16.51 | R1.1 7.58,16.51 | U3.33 48.24,32.02 v47.5,32.64 | v40.01,27.94 v33.02,21.08 | 7.58,16.51 7.46,16.64 6.35,16.64 3.81,19.18 J1.10 24.89,20.83 v25.15,21.08
  Bottom 0.254: v47.5,32.64 46.74,33.4 45.21,33.4 44.7,32.89 44.7,29.97 42.55,27.81 40.13,27.81 v40.01,27.94 | v25.15,21.08 v33.02,21.08 33.02,15.75 30.48,13.21 JP5.18 JP5.17
PTB0
  Top 0.254: U3.17 42.45,28.36 40.64,26.54 40.64,24.89 40.26,24.51 J2.1 40.26,20.95 38.1,18.8 JP7.2
  Bottom 0.254: JP7.1 JP7.2
PTB1  (via drill 0.33)
  Top 0.254: U3.18 42.95,28.22 41.15,26.42 41.15,21.21 38.61,18.67 38.61,6.22 JP7.4 | R7.2 v43.43,9.27
  Bottom 0.254: JP7.3 JP7.4 40.64,6.48 v43.43,9.27
PTB2
  Top 0.254: U3.21 44.45,19.17 45.21,18.41 45.21,6.22 JP7.6 43.18,7.62 41.91,8.89 R8.2
  Bottom 0.254: JP7.5 JP7.6
PTB17  (via drill 0.33)
  Top 0.254: U3.22 44.95,19.43 45.72,18.67 JP7.8 | R9.2 v40.39,10.79
  Bottom 0.254: JP7.7 JP7.8 45.72,8.64 43.56,10.79 v40.39,10.79
PTC1
  Top 0.254: U3.24 45.95,19.7 50.8,14.86 JP4.2
  Bottom 0.254: JP4.2 JP4.1
PTC2
  Top 0.254: U3.25 46.45,19.97 53.34,13.08 JP4.4
  Bottom 0.254: JP4.4 JP4.3
PTC3
  Top 0.254: U3.26 46.95,20.23 55.88,11.3 JP4.6
  Bottom 0.254: JP4.6 JP4.5
PTC4  (via drill 0.33)
  Top 0.254: U3.23 45.45,19.57 50.29,14.73 50.29,7.62 v49.02,6.35
  Bottom 0.254: JP4.7 JP4.8 56.26,6.35 v49.02,6.35
PTC5  (via drill 0.33)
  Top 0.254: U3.59 45.64,30.52 v45.47,30.61 | JP4.10 60.96,6.86 47.62,20.19 v47.62,27.94
  Bottom 0.254: JP4.10 JP4.9 | v45.47,30.61 47.62,28.45 v47.62,27.94
PTC6  (via drill 0.33)
  Top 0.254: U3.60 47.07,30.52 46.99,30.61 46.99,30.86 46.86,30.99 46.1,30.99 v45.47,31.62 | JP4.12 63.5,4.95 48.51,19.94 v48.51,27.94
  Bottom 0.254: JP4.12 JP4.11 | v45.47,31.62 48.51,28.57 v48.51,27.94
PTC7  (via drill 0.33)
  Top 0.254: U3.57 46.45,31.65 v45.47,32.64 | v49.4,27.94 49.4,19.68 63.37,5.71 64.52,5.71 JP4.14
  Bottom 0.254: JP4.14 JP4.13 | v45.47,32.64 49.4,28.7 v49.4,27.94
PTD0  (via drill 0.33)
  Top 0.254: U3.58 47.45,31.67 v46.48,32.64 | v50.29,27.94 56.77,27.94 JP3.4
  Bottom 0.254: v46.48,32.64 50.29,28.83 v50.29,27.94 | JP3.3 JP3.4
PTD4
  Top 0.254: U3.27 47.45,28.87 47.75,28.57 58.67,28.57 JP3.6
  Bottom 0.254: JP3.5 JP3.6
PTD5
  Top 0.254: U3.28 49.22,29.4 49.28,29.34 60.45,29.34 JP3.8
  Bottom 0.254: JP3.7 JP3.8
PTD6
  Top 0.254: U3.29 49.48,30.02 49.66,29.84 62.48,29.84 JP3.10
  Bottom 0.254: JP3.9 JP3.10
PTD7
  Top 0.254: U3.31 49.24,31.02 49.91,30.35 64.52,30.35 JP3.12
  Bottom 0.254: JP3.11 JP3.12
PTE0  (via drill 0.33)
  Top 0.254: U3.32 49.38,31.52 50.04,30.86 51.56,30.86 v51.56,31.11 | v63.5,48.26 57.28,48.26 52.7,43.81 v50.55,43.81
  Bottom 0.254: v51.56,31.11 51.56,31.88 48.77,34.67 48.77,37.34 50.29,38.86 50.29,43.56 v50.55,43.81 | JP2.3 JP2.4 v63.5,48.26
PTE1  (via drill 0.33)
  Top 0.254: U3.34 49.01,32.52 49.28,32.26 50.04,32.26 v50.55,31.75 | v60.96,49.28 57.15,49.28 52.7,44.83 v50.16,44.83
  Bottom 0.254: v50.55,31.75 48.26,34.04 48.26,37.47 49.78,38.99 49.78,44.45 v50.16,44.83 | JP2.5 60.96,67.06 JP2.6 v60.96,49.28
PTE2  (via drill 0.33)
  Top 0.254: U3.49 44.95,38.36 42.42,40.89 42.42,44.32 48.13,50.04 v58.42,50.04
  Bottom 0.254: JP2.7 JP2.8 v58.42,50.04
PTE3  (via drill 0.33)
  Top 0.254: U3.50 44.45,38.22 41.91,40.77 41.91,44.58 48.26,50.93 v55.88,50.93
  Bottom 0.254: JP2.9 JP2.10 v55.88,50.93
PTE16  (via drill 0.33)
  Top 0.254: U3.5 34.69,34.52 v34.54,34.67
  Bottom 0.254: v34.54,34.67 33.91,35.31 33.91,44.96 53.34,64.39 JP2.12 JP2.11
PTE17  (via drill 0.33)
  Top 0.254: U3.6 34.92,34.04 v34.54,33.66
  Bottom 0.254: v34.54,33.66 33.4,34.8 33.4,46.99 50.8,64.39 JP2.14 JP2.13
PTE18  (via drill 0.33)
  Top 0.254: U3.7 35.69,33.52 v35.18,33.02
  Bottom 0.254: v35.18,33.02 34.04,33.02 32.89,34.16 32.89,49.02 48.26,64.39 JP2.16 JP2.15
PTE19  (via drill 0.33)
  Top 0.254: U3.8 36.45,33.02 v35.81,32.38
  Bottom 0.254: v35.81,32.38 33.53,32.38 32.38,33.53 32.38,51.05 45.72,64.39 JP2.18 JP2.17
PTE30  (via drill 0.33)
  Top 0.254: U3.9 37.22,32.52 v36.45,31.75
  Bottom 0.254: v36.45,31.75 33.27,31.75 31.88,33.15 31.88,53.09 43.18,64.39 JP2.20 JP2.19
RESET(RF)  (via drill 0.33)
  Top 0.254: U3.48 45.45,38.87 v45.21,39.12 | v40.01,26.29 38.99,25.4 J2.2
  Bottom 0.254: v45.21,39.12 43.18,37.08 41.66,37.08 40.89,36.32 40.89,30.1 39.37,28.57 39.37,26.92 v40.01,26.29
RFIO
  Top 0.254: U3.39 50.55,35.02
  Top 0.762: C10.2 53.68,35.05 | L1.2 53.59,35.31 53.59,35.14 | 53.59,35.14 53.68,35.05 | 53.68,35.05 50.57,35.05 50.55,35.02 | C11.1 53.59,35.14
SHIELD
  Top 0.254: CF1.S3 4.88,51.49 4.57,51.18 2.49,51.18 CF1.S2 | CF1.S4 4.88,58.62 4.32,59.18 2.25,59.18 CF1.S1
  Top 0.508: R14.1 C20.1 1.87,58.83 CF1.S1
  Bottom 0.254: CF1.S3 CF1.S4
STAT1/LBO
  Top 0.254: U2.P$8 22.6,68.58 23.5,69.47 JP9.6 31.37,69.47 JP9.5 R5.1
STAT2
  Top 0.254: U2.P$7 23.1,68.44 23.62,68.96 25.65,68.96 27.69,66.93 JP9.4 JP9.3 R3.1
V+
  Top 0.508: 20.45,63.63 20.57,63.75 | C4.1 19.7,62.49 17.53,60.33 JP10.1 10.7,60.33 9.18,61.85 9.18,64.48 9.02,64.64 9.02,65.04 JP1.VCC
  pour Top (isolate 0.254, no thermals): 19.68,65.91 21.59,65.91 21.59,62.61 19.68,62.61
VBUS  (via drill 0.36)
  Top 0.254: U2.P$3 24.57,65.66 | 24.57,65.66 U2.P$2 | U2.P$9 v22.11,69.08 v22.1,69.09 | v25.78,65.66 24.57,65.66 | C17.1 10.03,56.64 10.16,56.52 TP5.P$1 | U2.P$18 U2.P$19 23.11,62.48 v22.86,62.36 22.61,62.61 U2.P$18
  Top 0.406: CF1.1 7.75,56.55 C17.1
  Top 0.762: C17.1 7.71,56.64 TP5.P$1 v13.46,56.64 v14.35,56.64 19.68,56.64 22.86,59.82 22.86,60.71 | 22.86,62.99 v22.86,62.36 22.86,60.71 | 22.86,60.71 C1.1
  Bottom 0.254: v22.1,69.09 23.11,69.09 24.64,67.56 24.64,66.8 v25.78,65.66 25.78,64.77 v22.86,62.36
  Bottom 0.762: v17.65,46.35 v16.38,47.62 16.38,50.93 15.37,51.94 15.37,56.64 v13.46,56.64 v15.24,56.64
  other vias: 17.02,46.99
  pour Top: 18.29,48.26 16.26,48.26 15.75,47.75 15.75,47.62 17.65,45.72 18.29,45.72
VOUT  (via drill 0.36)
  Top 0.254: S1.3 12.8,34.14 25.15,46.48 v25.15,52.7
  Bottom 0.254: v25.15,52.7 v25.15,58.04
  pour Top (isolate 0.254, no thermals): 23.37,65.02 25.65,65.02 25.65,60.2 25.91,60.2 25.91,58.42 27.05,58.42 27.05,57.66 23.24,57.66
VR_ANA
  Top 0.254: U3.44 47.45,38.95 49.28,40.77 C25.1
VR_DIG
  Top 0.254: U3.45 46.95,39.21 48.77,41.02 48.77,41.4 49.66,42.29 C23.1
VR_PA
  Top 0.254: TP15.P$1 49.57,37.97 49.53,38.01 | U3.42 48.58,37.15 48.64,37.21
  Top 0.762: C16.2 55.04,38.01 L1.1 49.53,38.01 49.44,38.01 48.64,37.21
XTA
  Top 0.254: U3.46 46.45,39.47 47.75,40.77 R6.2
XTB
  Top 0.254: U3.47 45.95,41.17 X1.1 44.12,41.19 C26.1

### Text on the board
tPlace: 3.3V | PTE30 | PTE19 | PTE18 | PTE17 | PTE16 | PTE3 | PTE2 | PTE1 | PTE0 | GND | V+ | PORT E | GND | DIO5 | GND | 3.3V | VOUT | DIO4 | VBUS | DIO3 | RF GPIO | DIO2 | DIO2 | 3.3V | CP2102_VDD | VR_PA | On/Off | Team 05 / William Harrington / James Heath / Saroj Bardewa / Shan Quinney / Michael Mathis | GND | PTD7 | PTD6 | PTD5 | PTD5 | PTD4 | PTD4 | PORT D | PTD0 | 3.3V | PORT A | PORT B | PTB17 | RESET | PTB0 | PTB1 | PTB1 | PTB2 | PTC1 | PTC2 | PORT C | PTC3 | PTC4 | PTC5 | PTC6 | PTC7 | GND | GND | PTA0 | PTA0 | PTA1 | PTA2 | PTA2 | PTA3 | PTA4 | PTA18 | PTA19 | PTA20 | 3.3V